# Altium project PAPI_M1_Sensor.PrjPcb
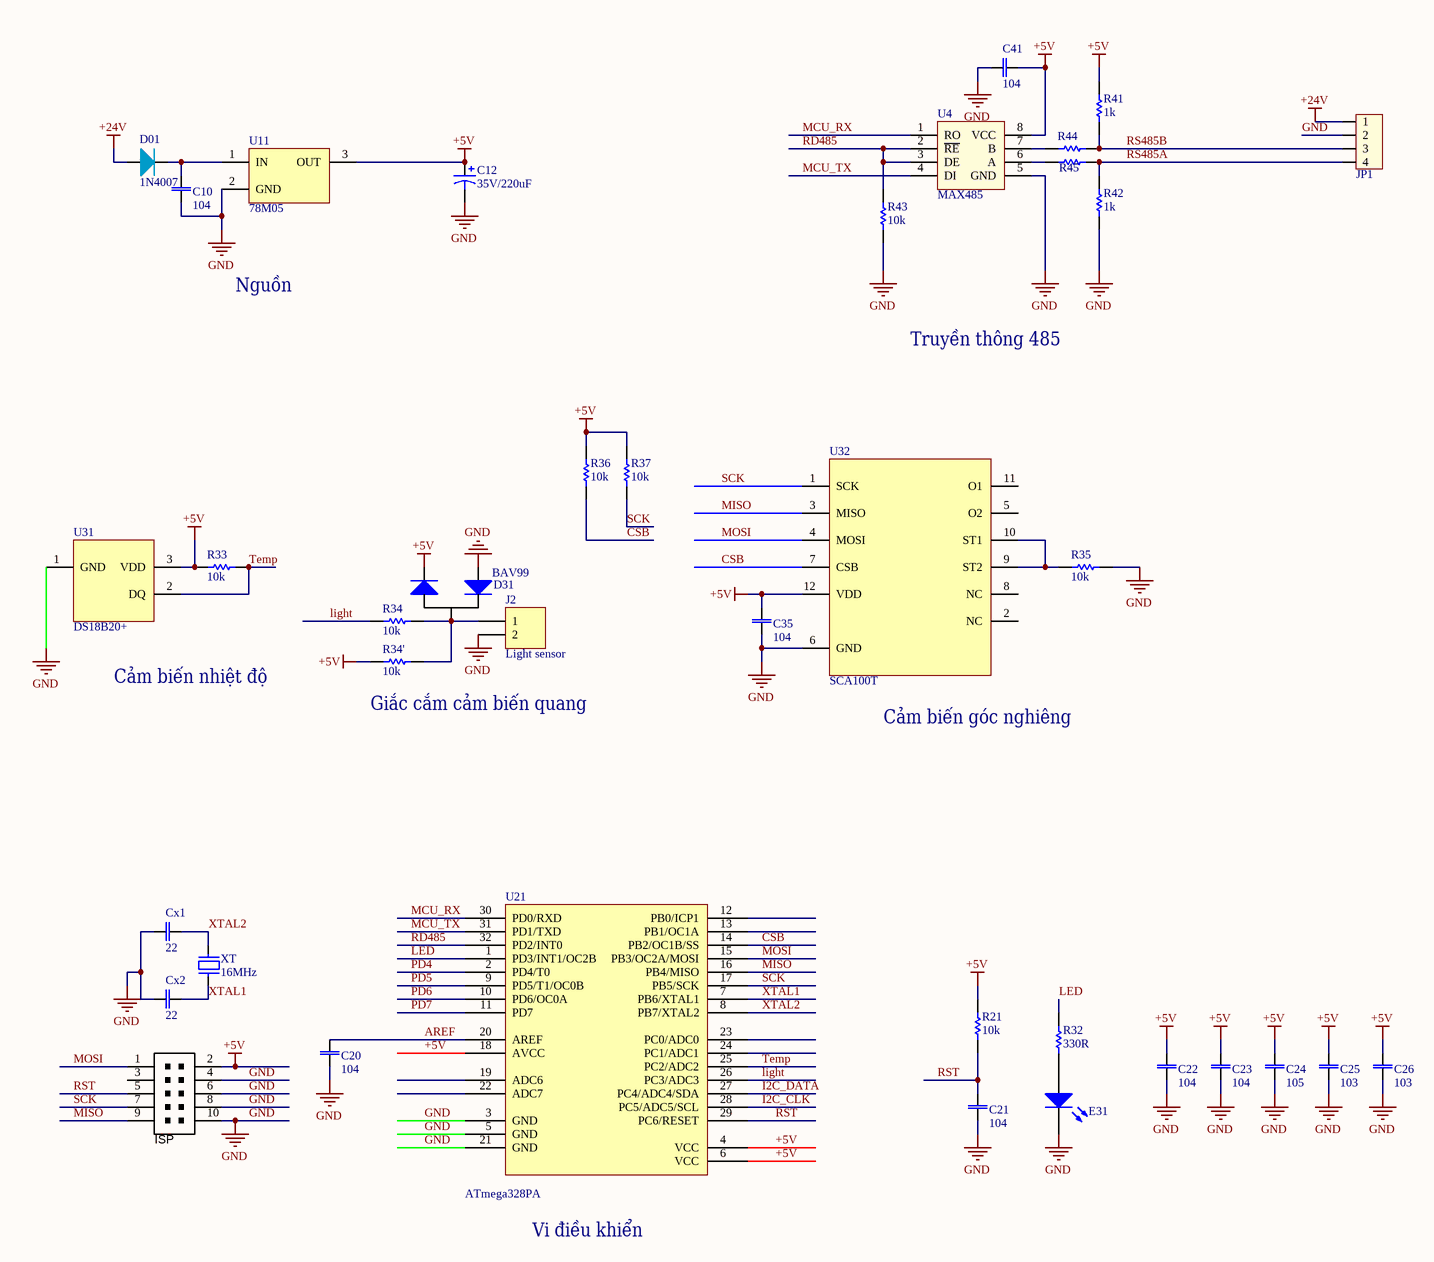
[diagram p0: PAPI_M1_Sensor.SchDoc]
1 sheet, 38 parts. Net scope: global (net labels, ports and power ports of the same name join across sheets).
Board file: PAPI_M1_Sensor.PcbDoc

## Sheet PAPI_M1_Sensor.SchDoc
size A3

### Parts
C10  value 104  [CAPC2012N_F]  (hidden comment: Tụ điện dán 0805104)
C12  value 35V/220uF  [CAPE3.5-5.0MM_Rad_10x14mm]  (hidden comment: Cap)
C20  value 104  [CAPC2012N_F]  (hidden comment: Tụ điện dán 0603104)
C21  value 104  [CAPC2012N_F]  (hidden comment: Tụ điện dán 0603104)
C22  value 104  [CAPC2012N_F]  (hidden comment: Tụ điện dán 0805104)
C23  value 104  [CAPC2012N_F]  (hidden comment: Tụ điện dán 0805104)
C24  value 105  [CAPC2012N_F]  (hidden comment: Tụ điện dán 0805105)
C25  value 103  [CAPC2012N_F]  (hidden comment: Tụ điện dán 0805103)
C26  value 103  [CAPC2012N_F]  (hidden comment: Tụ điện dán 0805103)
C35  value 104  [CAPC2012N_F]  (hidden comment: Tụ điện dán 0805104)
C41  value 104  [CAPC2012N_F]  (hidden comment: Tụ điện dán 0805104)
Cx1  value 22  [CAPC2012N_F]  (hidden comment: Tụ điện dán 060322)
Cx2  value 22  [CAPC2012N_F]  (hidden comment: Tụ điện dán 060322)
D01  vl1: 1N4007  [DO-41]  (hidden comment: Đi ốt cắm1N4007)
D31  BAV99  [SOT323]
E31  Led  [LED 5mm Green]  (value not drawn)
ISP  Giắc đôi 5x2 chân 2.54mm  [10P_PCB_HEADER_BRD_MNT]  (value not drawn)
J2  Light sensor  [HDR1X2]
JP1  JP4  [CON4]  (value not drawn)
R21  value 10k  [RESC2012N_F]  (hidden comment: Điện trở dán 060310k)
R32  value 330R  [RESC2012N_F]  (hidden comment: Điện trở dán 0603330R)
R33  value 10k  [RESC2012N_F]  (hidden comment: Res_10k_0603)
R34  value 10k  [RESC2012N_F]  (hidden comment: Res_10k_0603)
R34'  value 10k  [RESC2012N_F]  (hidden comment: Res_10k_0603)
R35  value 10k  [RESC2012N_F]  (hidden comment: Điện trở dán 060310k)
R36  value 10k  [RESC2012N_F]  (hidden comment: Điện trở dán 060310k)
R37  value 10k  [RESC2012N_F]  (hidden comment: Điện trở dán 060310k)
R41  value 1k  [RESC2012N_F]  (hidden comment: Res_1k_0603)
R42  value 1k  [RESC2012N_F]  (hidden comment: Res_1k_0603)
R43  value 10k  [RESC2012N_F]  (hidden comment: Res_10k_0603)
R44  Res_10R_0805  [RESC2012N_F]  (value not drawn)
R45  Res_10R_0805  [RESC2012N_F]  (value not drawn)
U4  MAX485  [SOIC 8]
U11  78M05  [TO252 D-PAK]
U21  ATmega328PA  [TQFP32]
U31  DS18B20+  [QTO-92]
U32  SCA100T  [SCA100T]
XT  16MHz  [XT2]

### Nets
+5V: C12.1 C22.2 C23.2 C24.2 C25.2 C26.2 C35.1 C41.1 D31.2(K) ISP.2 R21.2 R33.2 R34'.2 R36.1 R37.1 R41.2 U4.8(VCC) U11.3(OUT) U21.4(VCC) U21.6(VCC) U21.18(AVCC) U31.3(VDD) U32.12(VDD)
+24V: D01.A JP1.1
GND: C10.1 C12.2 C20.1 C21.1 C22.1 C23.1 C24.1 C25.1 C26.1 C35.2 C41.2 Cx1.2 Cx2.2 D31.1(A) E31.2(K) ISP.4 ISP.6 ISP.8 ISP.10 J2.2 JP1.2 R35.1 R42.1 R43.1 U4.5(GND) U11.2(GND) U21.3(GND) U21.5(GND) U21.21(GND) U31.1(GND) U32.6(GND)
AREF: C20.2 U21.20(AREF)
CSB: R36.2 U21.14(PB2/OC1B/SS) U32.7(CSB)
I2C_CLK: U21.28(PC5/ADC5/SCL)
I2C_DATA: U21.27(PC4/ADC4/SDA)
LED: R32.1 U21.1(PD3/INT1/OC2B)
light: R34.1 U21.26(PC3/ADC3)
MCU_RX: U4.1(RO) U21.30(PD0/RXD)
MCU_TX: U4.4(DI) U21.31(PD1/TXD)
MISO: ISP.9 U21.16(PB4/MISO) U32.3(MISO)
MOSI: ISP.1 U21.15(PB3/OC2A/MOSI) U32.4(MOSI)
PD4: U21.2(PD4/T0)
PD5: U21.9(PD5/T1/OC0B)
PD6: U21.10(PD6/OC0A)
PD7: U21.11(PD7)
RD485: R43.2 U4.2(~{RE}) U4.3(DE) U21.32(PD2/INT0)
RS485A: JP1.4 R42.2 R45.2
RS485B: JP1.3 R41.1 R44.2
RST: C21.2 ISP.5 R21.1 U21.29(PC6/RESET)
SCK: ISP.7 R37.2 U21.17(PB5/SCK) U32.1(SCK)
Temp: R33.1 U21.25(PC2/ADC2) U31.2(DQ)
XTAL1: Cx2.1 U21.7(PB6/XTAL1) XT.1
XTAL2: Cx1.1 U21.8(PB7/XTAL2) XT.2
NetC10_2: C10.2 D01.K U11.1(IN)
NetD31_3: D31.3(AK) J2.1 R34.2 R34'.1
NetE31_1: E31.1(A) R32.2
NetR35_2: R35.2 U32.9(ST2) U32.10(ST1)
NetR44_1: R44.1 U4.7(B)
NetR45_1: R45.1 U4.6(A)

Not connected (* = marked no-connect by the designer): ISP 3; U21 12(PB0/ICP1) 13(PB1/OC1A) 19(ADC6) 22(ADC7) 23(PC0/ADC0) 24(PC1/ADC1); U32 2(NC) 5(O2) 8(NC) 11(O1)

### Notes on the sheet
- Nguồn
- Truyền thông 485
- Cảm biến nhiệt độ
- (near R34') Giắc cắm cảm biến quang
- Cảm biến góc nghiêng
- Vi điều khiển

### Library data of the parts
C10 C22-C26 C35 C41 = CAP NP: Capacitor non polarized; cm1: Tụ điện dán 0603; cm3: Tụ điện dán 1206; cm2: Tụ điện dán 0805
C20 C21 Cx1 Cx2 = CAP NP: Capacitor non polarized; cm2: Tụ điện dán 0805; cm3: Tụ điện dán 1206; cm1: Tụ điện dán 0603
D01 = Diode: cm2: Đi ốt dán; vl3: TVS 1.5KE300A 19A 300V; vl4: HER508 5A 1000V; cm1: Đi ốt cắm
D31 = BAV99W: Diode Array 1 Pair Series Connection Standard 70V 215mA (DC) Surface Mount SC-70, SOT-323
ISP = CONN_HEADER_2x5P_0.100in_Male: Header THD 10 POS Double-row 2.54mm pitch; Manufacturer 1: 3M; Manufacturer Part Number 1: D2510-6002-AR; Pitch: 0.100" (2.54mm); Value: Double-row, 10 positions; QtyOverride: 1; Connector Type: Header, Shrouded; Number of Positions: 10; Package / Case: Connector header; 2.54mm pitch; Contact Type: Male Pin; Number of Rows: 2; Row Spacing: 0.100" (2.54mm); Contact Mating Length: 0.243" (6.17mm); ComponentLink1URL: http://multimedia.3m.com/mws/mediawebserver?66666UuZjcFSLXTtm8T_oxMcEVuQEcuZgVs6EVs6E666666--; ComponentLink1Description: http://multimedia.3m.com/mws/mediawebserver?66666UuZjcFSLXTtm8T_oxMcEVuQEcuZgVs6EVs6E666666--; Supplier 1: Digi-Key; Supplier Part Number 1: MHC10E-ND
J2 = Header 2: Header, 2-Pin; LatestRevisionDate: 17-Jul-2002; LatestRevisionNote: Re-released for DXP Platform.; Publisher: Altium Limited
JP1 = Con4: Connector 4; Value: Connector 4
R21 R32 R35-R37 = Res: Resistor; cm2: Điện trở cắm 1/4W; cm3: Điện trở dán 0805; cm4: Điện trở dán 1206; cm1: Điện trở dán 0603
R33 R34 R34' R41-R43 = Res
R44 R45 = Res: Value: 10R
U4 = MAX485: RS232 - RS485 (Same sn75176)
U11 = LM78xx: Linear Voltage Regulators 5V 500mA Positive
U21 = ATmega48/168/328
U31 = DS18B20: SENSOR TEMPERATURE 1-WIRE TO92-3; Digi-Key Part Number: DS18B20+-ND
U32 = SCA100T: Accelerometer X, Y Axis ±12g 400Hz 12-SMD
XT = Crystal